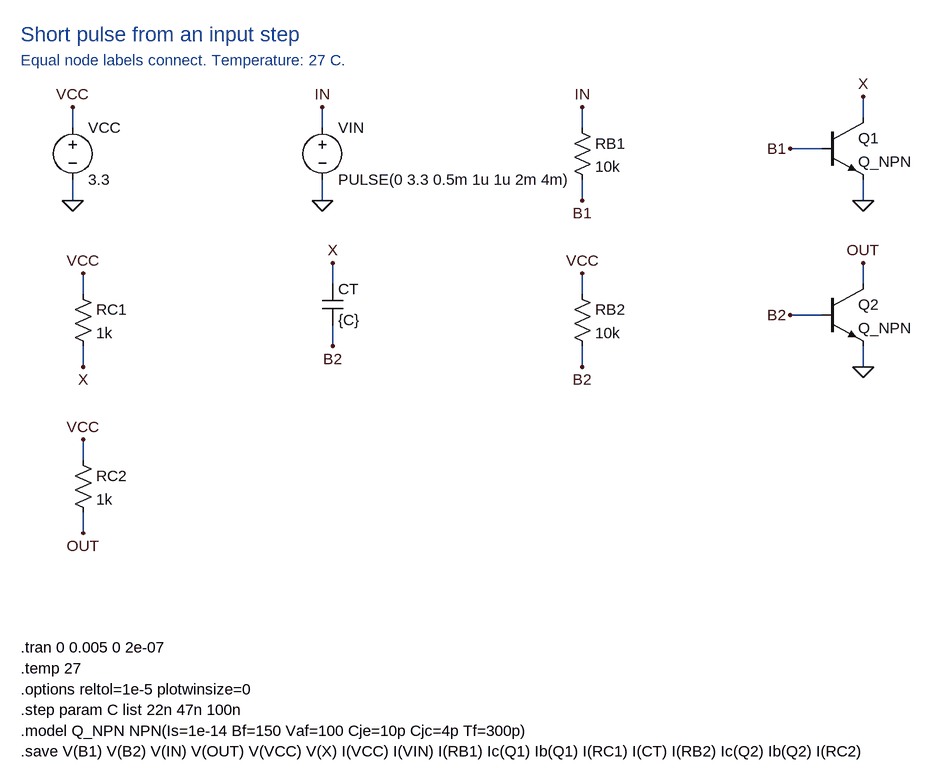
[diagram p0: schematic short-pulse-generator.asc]
short-pulse-generator.asc, the LTspice schematic file:
Version 4
SHEET 1 1740 1288
WIRE 144 176 144 144
WIRE 144 256 144 288
WIRE 528 176 528 144
WIRE 528 256 528 288
WIRE 928 176 928 144
WIRE 928 256 928 288
WIRE 1360 160 1360 128
WIRE 1296 208 1248 208
WIRE 1360 256 1360 288
WIRE 160 432 160 400
WIRE 160 512 160 544
WIRE 544 416 544 384
WIRE 544 480 544 512
WIRE 928 432 928 400
WIRE 928 512 928 544
WIRE 1360 416 1360 384
WIRE 1296 464 1248 464
WIRE 1360 512 1360 544
WIRE 160 688 160 656
WIRE 160 768 160 800
FLAG 144 144 VCC
FLAG 144 288 0
FLAG 528 144 IN
FLAG 528 288 0
FLAG 928 144 IN
FLAG 928 288 B1
FLAG 1360 128 X
FLAG 1248 208 B1
FLAG 1360 288 0
FLAG 160 400 VCC
FLAG 160 544 X
FLAG 544 384 X
FLAG 544 512 B2
FLAG 928 400 VCC
FLAG 928 544 B2
FLAG 1360 384 OUT
FLAG 1248 464 B2
FLAG 1360 544 0
FLAG 160 656 VCC
FLAG 160 800 OUT
SYMBOL voltage 144 160 R0
SYMATTR InstName VCC
SYMATTR Value 3.3
SYMBOL voltage 528 160 R0
SYMATTR InstName VIN
SYMATTR Value PULSE(0 3.3 0.5m 1u 1u 2m 4m)
SYMBOL res 912 160 R0
SYMATTR InstName RB1
SYMATTR Value 10k
SYMBOL npn 1296 160 R0
SYMATTR InstName Q1
SYMATTR Value Q_NPN
SYMBOL res 144 416 R0
SYMATTR InstName RC1
SYMATTR Value 1k
SYMBOL cap 528 416 R0
SYMATTR InstName CT
SYMATTR Value {C}
SYMBOL res 912 416 R0
SYMATTR InstName RB2
SYMATTR Value 10k
SYMBOL npn 1296 416 R0
SYMATTR InstName Q2
SYMATTR Value Q_NPN
SYMBOL res 144 672 R0
SYMATTR InstName RC2
SYMATTR Value 1k
TEXT 64 32 Left 3 ;Short pulse from an input step
TEXT 64 72 Left 2 ;Equal node labels connect. Temperature: 27 C.
TEXT 64 976 Left 2 !.tran 0 0.005 0 2e-07
TEXT 64 1008 Left 2 !.temp 27
TEXT 64 1040 Left 2 !.options reltol=1e-5 plotwinsize=0
TEXT 64 1072 Left 2 !.step param C list 22n 47n 100n
TEXT 64 1104 Left 2 !.model Q_NPN NPN(Is=1e-14 Bf=150 Vaf=100 Cje=10p Cjc=4p Tf=300p)
TEXT 64 1136 Left 2 !.save V(B1) V(B2) V(IN) V(OUT) V(VCC) V(X) I(VCC) I(VIN) I(RB1) Ic(Q1) Ib(Q1) I(RC1) I(CT) I(RB2) Ic(Q2) Ib(Q2) I(RC2)

The netlist it stands for:
* short-pulse-generator.asc
VCC VCC 0 3.3
VIN IN 0 PULSE(0 3.3 0.5m 1u 1u 2m 4m)
RB1 IN B1 10k
Q1 X B1 0 0 Q_NPN
RC1 VCC X 1k
CT X B2 {C}
RB2 VCC B2 10k
Q2 OUT B2 0 0 Q_NPN
RC2 VCC OUT 1k
.model NPN NPN
.model PNP PNP
.lib standard.bjt
* Short pulse from an input step
* Equal node labels connect. Temperature: 27 C.
.tran 0 0.005 0 2e-07
.temp 27
.options reltol=1e-5 plotwinsize=0
.step param C list 22n 47n 100n
.model Q_NPN NPN(Is=1e-14 Bf=150 Vaf=100 Cje=10p Cjc=4p Tf=300p)
.save V(B1) V(B2) V(IN) V(OUT) V(VCC) V(X) I(VCC) I(VIN) I(RB1) Ic(Q1) Ib(Q1) I(RC1) I(CT) I(RB2) Ic(Q2) Ib(Q2) I(RC2)
.backanno
.end